# EasyEDA schematic SCH_mosfet_driver copy_2022-10-09.json
TITLE: MOSFET_Driver copy; REV: 1.0; Date: 2022-10-09; Sheet: 1/1; Drawn By: johnsonwust; Company: Your Company
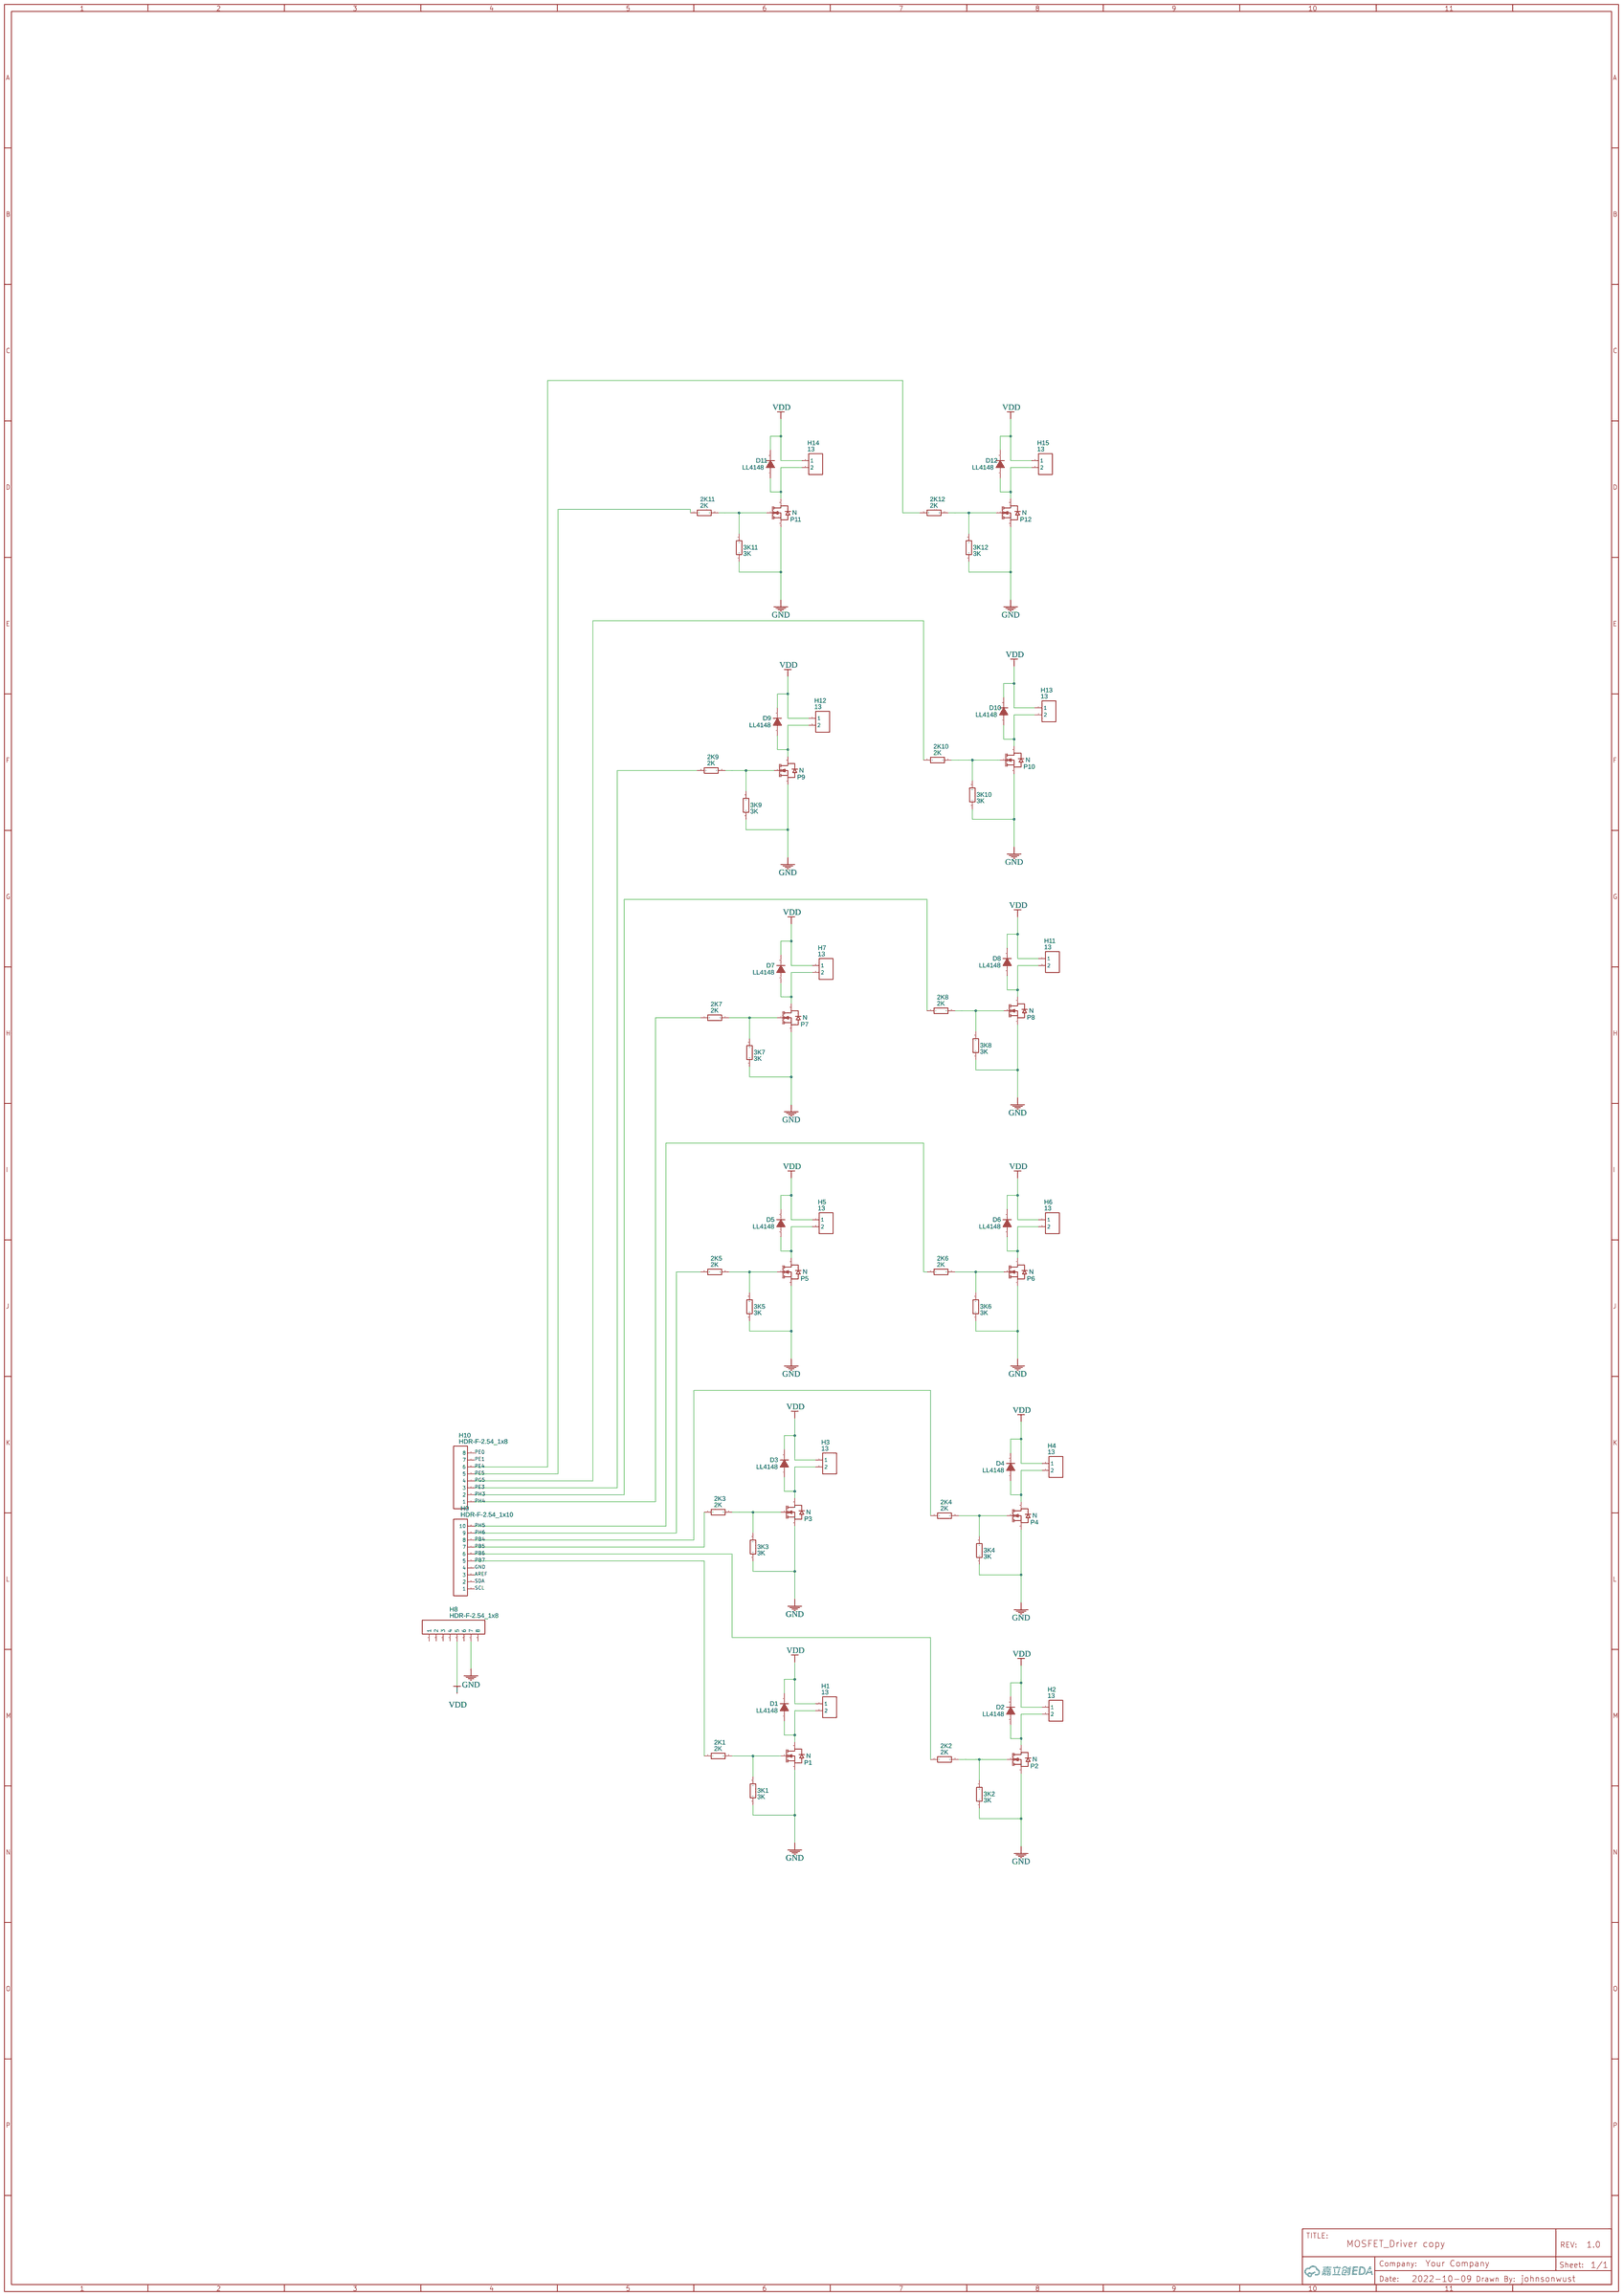
[diagram p0: schematic sheet]

## Parts
2K1  2K  [R0805]
2K2  2K  [R0805]
2K3  2K  [R0805]
2K4  2K  [R0805]
2K5  2K  [R0805]
2K6  2K  [R0805]
2K7  2K  [R0805]
2K8  2K  [R0805]
2K9  2K  [R0805]
2K10  2K  [R0805]
2K11  2K  [R0805]
2K12  2K  [R0805]
3K1  3K  [R0805]
3K2  3K  [R0805]
3K3  3K  [R0805]
3K4  3K  [R0805]
3K5  3K  [R0805]
3K6  3K  [R0805]
3K7  3K  [R0805]
3K8  3K  [R0805]
3K9  3K  [R0805]
3K10  3K  [R0805]
3K11  3K  [R0805]
3K12  3K  [R0805]
D1  LL4148  [LL-34_L3.5-W1.5-R-RD]
D2  LL4148  [LL-34_L3.5-W1.5-R-RD]
D3  LL4148  [LL-34_L3.5-W1.5-R-RD]
D4  LL4148  [LL-34_L3.5-W1.5-R-RD]
D5  LL4148  [LL-34_L3.5-W1.5-R-RD]
D6  LL4148  [LL-34_L3.5-W1.5-R-RD]
D7  LL4148  [LL-34_L3.5-W1.5-R-RD]
D8  LL4148  [LL-34_L3.5-W1.5-R-RD]
D9  LL4148  [LL-34_L3.5-W1.5-R-RD]
D10  LL4148  [LL-34_L3.5-W1.5-R-RD]
D11  LL4148  [LL-34_L3.5-W1.5-R-RD]
D12  LL4148  [LL-34_L3.5-W1.5-R-RD]
H1  13  [HDR-F-2.54_1X2]
H2  13  [HDR-F-2.54_1X2]
H3  13  [HDR-F-2.54_1X2]
H4  13  [HDR-F-2.54_1X2]
H5  13  [HDR-F-2.54_1X2]
H6  13  [HDR-F-2.54_1X2]
H7  13  [HDR-F-2.54_1X2]
H8  HDR-F-2.54_1x8  [HDR-F-2.54_1X8]
H9  HDR-F-2.54_1x10  [HDR-F-2.54_1X10]
H10  HDR-F-2.54_1x8  [HDR-F-2.54_1X8]
H11  13  [HDR-F-2.54_1X2]
H12  13  [HDR-F-2.54_1X2]
H13  13  [HDR-F-2.54_1X2]
H14  13  [HDR-F-2.54_1X2]
H15  13  [HDR-F-2.54_1X2]
P1  N  [SOT-23-3_L2.9-W1.3-P1.90-LS2.4-BR]
P2  N  [SOT-23-3_L2.9-W1.3-P1.90-LS2.4-BR]
P3  N  [SOT-23-3_L2.9-W1.3-P1.90-LS2.4-BR]
P4  N  [SOT-23-3_L2.9-W1.3-P1.90-LS2.4-BR]
P5  N  [SOT-23-3_L2.9-W1.3-P1.90-LS2.4-BR]
P6  N  [SOT-23-3_L2.9-W1.3-P1.90-LS2.4-BR]
P7  N  [SOT-23-3_L2.9-W1.3-P1.90-LS2.4-BR]
P8  N  [SOT-23-3_L2.9-W1.3-P1.90-LS2.4-BR]
P9  N  [SOT-23-3_L2.9-W1.3-P1.90-LS2.4-BR]
P10  N  [SOT-23-3_L2.9-W1.3-P1.90-LS2.4-BR]
P11  N  [SOT-23-3_L2.9-W1.3-P1.90-LS2.4-BR]
P12  N  [SOT-23-3_L2.9-W1.3-P1.90-LS2.4-BR]

## Library data of the parts
2K1-2K12 = 0805W8F1003T5E: Supplier: LCSC; Manufacturer: UniOhm; Supplier Part: C17407; JLCPCB Part Class: Basic Part
3K1-3K12 = 0805W8F1001T5E: Supplier: LCSC; Manufacturer: UniOhm; Supplier Part: C17513; JLCPCB Part Class: Basic Part
D1-D12 = LL4148: Supplier: LCSC; Manufacturer: SEMTECH; Supplier Part: C9808; JLCPCB Part Class: Basic Part
H1-H7 H11-H15 = HDR-F-2.54_1x2: Supplier Part: C49661; Supplier: LCSC; Contributor: LCEDA_Lib
H8 H10 = HDR-F-2.54_1x8: Supplier Part: C225505; Supplier: LCSC; Contributor: LCEDA_Lib
H9 = HDR-F-2.54_1x10: Supplier Part: C35445; Supplier: LCSC; Contributor: LCEDA_Lib
P1-P12 = BSS138_C779768: Supplier: LCSC; Supplier Part: C779768; Manufacturer: ZRE; Manufacturer Part: BSS138; Contributor: LCSC; JLCPCB Part Class: Extended Part

## Nets
GND: 3K1.1 3K2.1 3K3.1 3K4.1 3K5.1 3K6.1 3K7.1 3K8.1 3K9.1 3K10.1 3K11.1 3K12.1 H8.7 H9.4 P1.2(S) P2.2(S) P3.2(S) P4.2(S) P5.2(S) P6.2(S) P7.2(S) P8.2(S) P9.2(S) P10.2(S) P11.2(S) P12.2(S)
VDD: D1.2(K) D2.2(K) D3.2(K) D4.2(K) D5.2(K) D6.2(K) D7.2(K) D8.2(K) D9.2(K) D10.2(K) D11.2(K) D12.2(K) H1.1 H2.1 H3.1 H4.1 H5.1 H6.1 H7.1 H8.5 H11.1 H12.1 H13.1 H14.1 H15.1
AREF: H9.3
PB4: 2K4.1 H9.8
PB5: 2K3.1 H9.7
PB6: 2K2.1 H9.6
PB7: 2K1.1 H9.5
PE0: H10.8
PE1: H10.7
PE3: 2K9.1 H10.3
PE4: 2K12.1 H10.6
PE5: 2K11.1 H10.5
PG5: 2K10.1 H10.4
PH3: 2K8.1 H10.2
PH4: 2K7.1 H10.1
PH5: 2K6.1 H9.10
PH6: 2K5.1 H9.9
SCL: H9.1
SDA: H9.2
Net-(2K1-2): 2K1.2 3K1.2 P1.1(G)
Net-(2K2-2): 2K2.2 3K2.2 P2.1(G)
Net-(2K3-2): 2K3.2 3K3.2 P3.1(G)
Net-(2K4-2): 2K4.2 3K4.2 P4.1(G)
Net-(2K5-2): 2K5.2 3K5.2 P5.1(G)
Net-(2K6-2): 2K6.2 3K6.2 P6.1(G)
Net-(2K7-2): 2K7.2 3K7.2 P7.1(G)
Net-(2K8-2): 2K8.2 3K8.2 P8.1(G)
Net-(2K9-2): 2K9.2 3K9.2 P9.1(G)
Net-(2K10-2): 2K10.2 3K10.2 P10.1(G)
Net-(2K11-2): 2K11.2 3K11.2 P11.1(G)
Net-(2K12-2): 2K12.2 3K12.2 P12.1(G)
Net-(D1-1): D1.1(A) H1.2 P1.3(D)
Net-(D2-1): D2.1(A) H2.2 P2.3(D)
Net-(D3-1): D3.1(A) H3.2 P3.3(D)
Net-(D4-1): D4.1(A) H4.2 P4.3(D)
Net-(D5-1): D5.1(A) H5.2 P5.3(D)
Net-(D6-1): D6.1(A) H6.2 P6.3(D)
Net-(D7-1): D7.1(A) H7.2 P7.3(D)
Net-(D8-1): D8.1(A) H11.2 P8.3(D)
Net-(D9-1): D9.1(A) H12.2 P9.3(D)
Net-(D10-1): D10.1(A) H13.2 P10.3(D)
Net-(D11-1): D11.1(A) H14.2 P11.3(D)
Net-(D12-1): D12.1(A) H15.2 P12.3(D)

Not connected (* = marked no-connect by the designer): H8 1 2 3 4 6 8
